# Altium schematic sheet DigitalLabBoard_LEDs.SchDoc
size A4
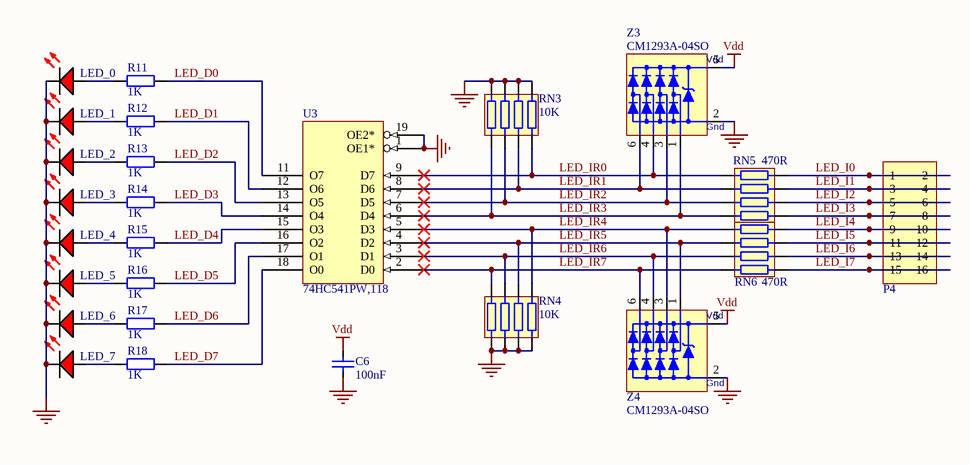
[diagram p0: DigitalLabBoard_LEDs.SchDoc]

## Parts
C6  100nF  [CCNP1608-0603]
LED_0  LED Red  [LED1608-0603-RED]  (value not drawn)
LED_1  LED Red  [LED1608-0603-RED]  (value not drawn)
LED_2  LED Red  [LED1608-0603-RED]  (value not drawn)
LED_3  LED Red  [LED1608-0603-RED]  (value not drawn)
LED_4  LED Red  [LED1608-0603-RED]  (value not drawn)
LED_5  LED Red  [LED1608-0603-RED]  (value not drawn)
LED_6  LED Red  [LED1608-0603-RED]  (value not drawn)
LED_7  LED Red  [LED1608-0603-RED]  (value not drawn)
P4  Header 2x8  [HDR2X8S]  (value not drawn)
R11  1K  [CR1608-0603]
R12  1K  [CR1608-0603]
R13  1K  [CR1608-0603]
R14  1K  [CR1608-0603]
R15  1K  [CR1608-0603]
R16  1K  [CR1608-0603]
R17  1K  [CR1608-0603]
R18  1K  [CR1608-0603]
RN3  10K  [CR1206-0603_X4_N]
RN4  10K  [CR1206-0603_X4_N]
RN5  470R  [CR1206-0603_X4_N]
RN6  470R  [CR1206-0603_X4_N]
U3  74HC541PW,118  [TSSOP20_N]
Z3  CM1293A-04SO  [SOT457_N]
Z4  CM1293A-04SO  [SOT457_N]

## Nets
GND: C6.1 LED_0.K LED_1.K LED_2.K LED_3.K LED_4.K LED_5.K LED_6.K LED_7.K RN3.1 RN3.2 RN3.3 RN3.4 RN4.1 RN4.2 RN4.3 RN4.4 U3.1(OE1*) U3.10(Gnd) U3.19(OE2*) Z3.2 Z4.2(Vn)
Vcc: U3.20(Vdd)
Vdd: C6.2 Z3.5 Z4.5(Vp)
LED_D0: R11.2 U3.11(O7)
LED_D1: R12.2 U3.12(O6)
LED_D2: R13.2 U3.13(O5)
LED_D3: R14.2 U3.14(O4)
LED_D4: R15.2 U3.15(O3)
LED_D5: R16.2 U3.16(O2)
LED_D6: R17.2 U3.17(O1)
LED_D7: R18.2 U3.18(O0)
LED_I0: P4.1 P4.2 RN5.5
LED_I1: P4.3 P4.4 RN5.6
LED_I2: P4.5 P4.6 RN5.7
LED_I3: P4.7 P4.8 RN5.8
LED_I4: P4.9 P4.10 RN6.5
LED_I5: P4.11 P4.12 RN6.6
LED_I6: P4.13 P4.14 RN6.7
LED_I7: P4.15 P4.16 RN6.8
LED_IR0: RN3.5 RN5.4 U3.9(D7) Z3.4
LED_IR1: RN3.6 RN5.3 U3.8(D6) Z3.6
LED_IR2: RN3.7 RN5.2 U3.7(D5) Z3.3
LED_IR3: RN3.8 RN5.1 U3.6(D4) Z3.1
LED_IR4: RN4.5 RN6.4 U3.5(D3) Z4.3
LED_IR5: RN4.6 RN6.3 U3.4(D2) Z4.1
LED_IR6: RN4.7 RN6.2 U3.3(D1) Z4.4
LED_IR7: RN4.8 RN6.1 U3.2(D0) Z4.6
NetLED_0_A: LED_0.A R11.1
NetLED_1_A: LED_1.A R12.1
NetLED_2_A: LED_2.A R13.1
NetLED_3_A: LED_3.A R14.1
NetLED_4_A: LED_4.A R15.1
NetLED_5_A: LED_5.A R16.1
NetLED_6_A: LED_6.A R17.1
NetLED_7_A: LED_7.A R18.1

## Notes on the sheet
- (in symbol CM1293A-04SO) Vdd; Gnd

## Library data of the parts
C6 = Cap_CCNP_0603: Capacitor non-polar SMT 0603; Manufacturer: Generic Components; Class: Passive; Published: 08/06/2000; Publisher: Altium Hobart Technology Centre; SubClass: Capacitor; Farnell PN: *; Digikey: *; Value: 100nF; LCSC: C14663
LED_0-LED_7 = LED-0603-Red: LED 0603 Red; Manufacturer: Generic Components; Class I: Optoelectronic; Published: 8-Jun-2000; Revision: July-2002: Re-released for DXP Platform.; Publisher: Altium Limited; Class II: LED; Farnell PN: 1581239; Digikey: *; LCSC: C2286
R11-R18 = Res_CR0603: Resistor SMT 0603; Manufacturer: Generic Components; Class: Passive; Published: 08/06/2000; Publisher: Altium Hobart Technology Centre; SubClass: Resistor; Farnell PN: *; Digikey: *; Value: 1K; LCSC: C21190
RN3 RN4 = ResistorNetwork_CR0603x4: SMT x4 Resistor Array; Farnell PN: *; Digikey: *; Value: 10K; LCSC: C29718
RN5 RN6 = ResistorNetwork_CR0603x4: SMT x4 Resistor Array; Value: 470 ohm; Farnell PN: *; Digikey: *; LCSC: C25510
U3 = 74HC541PW,118: Octal 3-State Buffer/Line Driver/LineReceiver; Digikey: 1727-5960-1-ND; Farnell PN: 2444902; LCSC: C5657
Z3 Z4 = CM1293A-04SO: Ultra low capacitance quadruple rail-to-rail ESD protection; Farnell PN: 2533258; Digikey: CM1293A-04SOOSCT-ND; LCSC: C393377
P4 = Header 2x8: Digikey: A26528-08-ND; Parameter 2: *